# Altium project LO.PrjPcb
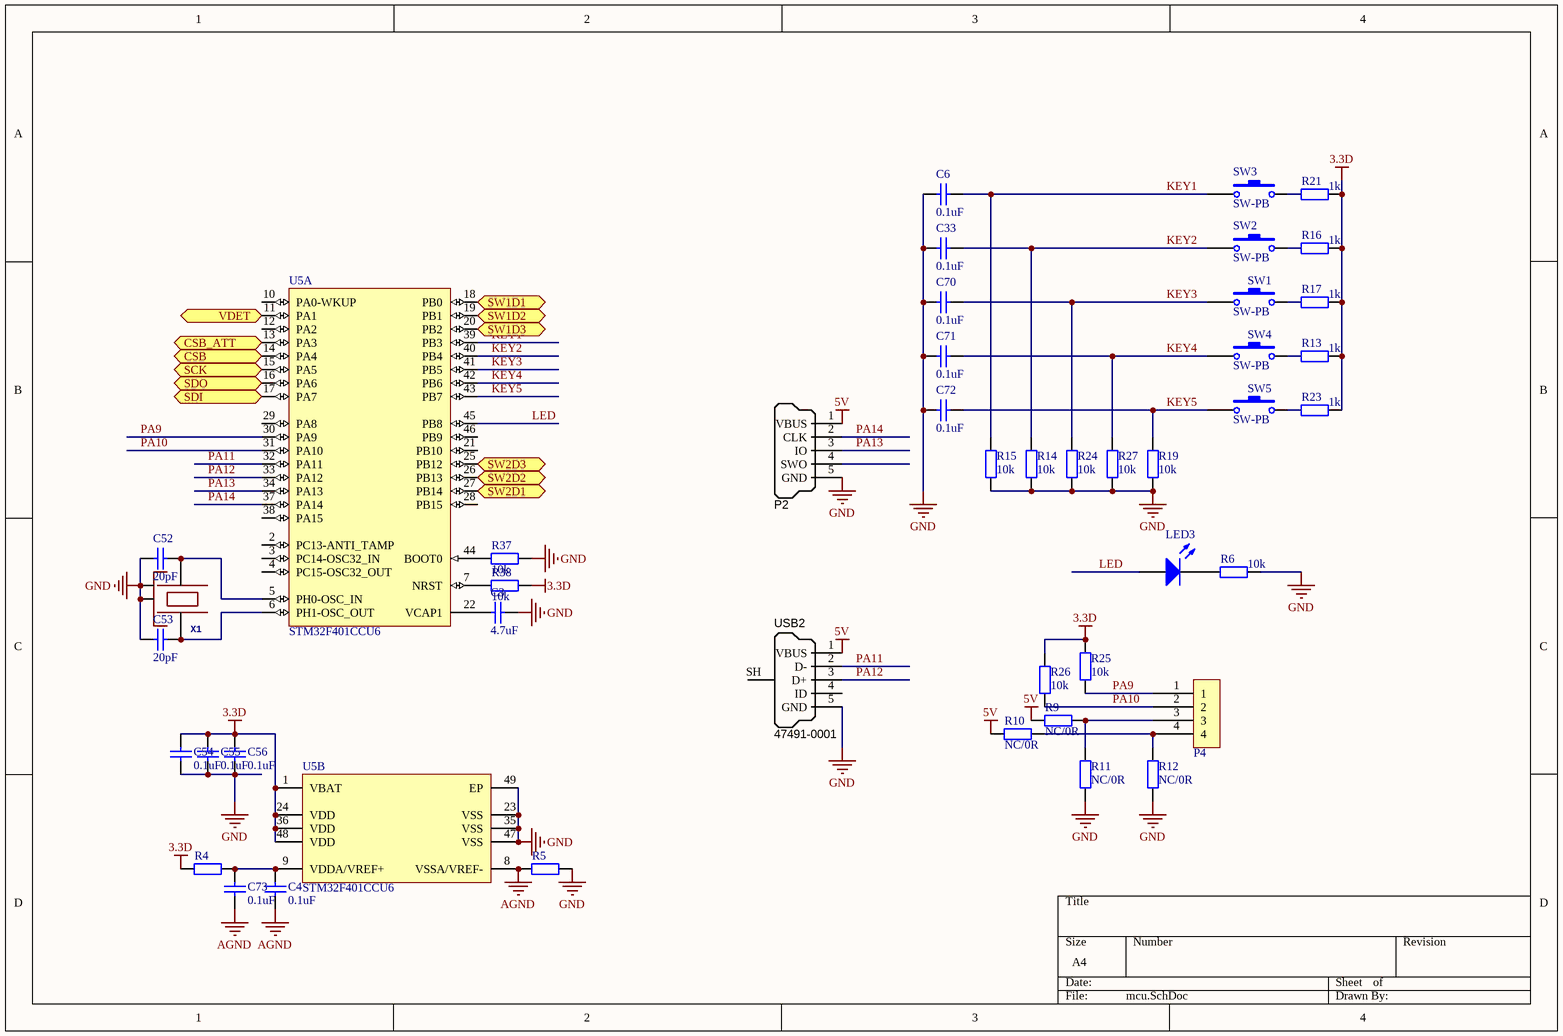
[diagram p0: mcu.SchDoc]
4 sheets, 148 parts. Net scope: flat (ports and power ports of the same name join across sheets).
Board file: LO.PcbDoc
Sheets:
  mcu.SchDoc
  filterbank_amp.SchDoc
  source.SchDoc
  power.SchDoc

## Sheet mcu.SchDoc
size A4

### Parts
C3  value 4.7uF  [0603]  (hidden comment: Cap)
C4  value 0.1uF  [0402]  (hidden comment: Cap)
C6  value 0.1uF  [0402]  (hidden comment: Cap)
C33  value 0.1uF  [0402]  (hidden comment: Cap)
C52  value 20pF  [0402]  (hidden comment: Cap)
C53  value 20pF  [0402]  (hidden comment: Cap)
C54  value 0.1uF  [0402]  (hidden comment: Cap)
C55  value 0.1uF  [0402]  (hidden comment: Cap)
C56  value 0.1uF  [0402]  (hidden comment: Cap)
C70  value 0.1uF  [0402]  (hidden comment: Cap)
C71  value 0.1uF  [0402]  (hidden comment: Cap)
C72  value 0.1uF  [0402]  (hidden comment: Cap)
C73  value 0.1uF  [0402]  (hidden comment: Cap)
LED3  LED0  [0603]  (value not drawn)
P2  SWD_MicroUSB  [MICRO-YZX]  (value not drawn)
P4  UART/I2C  [4pSocket]  (value not drawn)
R4  0R/FB  [0402]  (value not drawn)
R5  0R/FB  [0402]  (value not drawn)
R6  10k  [0402]
R9  NC/0R  [0402]
R10  NC/0R  [0402]
R11  NC/0R  [0402]
R12  NC/0R  [0402]
R13  1k  [0402]
R14  10k  [0402]
R15  10k  [0402]
R16  1k  [0402]
R17  1k  [0402]
R19  10k  [0402]
R21  1k  [0402]
R23  1k  [0402]
R24  10k  [0402]
R25  10k  [0402]
R26  10k  [0402]
R27  10k  [0402]
R37  value 10k  [0402]  (hidden comment: Res2)
R38  value 10k  [0402]  (hidden comment: Res2)
SW1  SW-PB  [SW3x4]
SW2  SW-PB  [SW3x4]
SW3  SW-PB  [SW3x4]
SW4  SW-PB  [SW3x4]
SW5  SW-PB  [SW3x4]
U5  STM32F401CCU6  [STM-UFQFPN48_N]  (parts A,B of 2)
USB2  Manufacturer Part Number 1: 47491-0001  [MICRO-YZX]  (hidden comment: USB Micro Type B)
X1  24.000 KHz 3.2x2.5mm 8-10pf  [OSCILLATOR-3.2X2.5]  (value not drawn)

### Ports
CSB, CSB_ATT, SCK, SDI, SDO, SW1D1, SW1D2, SW1D3, SW2D1, SW2D2, SW2D3, VDET

### Nets
3.3D: C54.2 C55.2 C56.2 R4.2 R13.2 R16.2 R17.2 R21.2 R23.2 R25.2 R26.2 R38.1 U5.1(VBAT) U5.24(VDD) U5.36(VDD) U5.48(VDD)
5V: P2.1(VBUS) R9.2 R10.2 USB2.1(VBUS)
AGND: C4.1 C73.1 R5.2 U5.8(VSSA/VREF-)
GND: C3.1 C6.1 C33.2 C52.1 C53.1 C54.1 C55.1 C56.1 C70.2 C71.2 C72.2 P2.5(GND) R5.1 R6.2 R11.1 R12.1 R14.1 R15.1 R19.1 R24.1 R27.1 R37.2 U5.23(VSS) U5.35(VSS) U5.47(VSS) U5.49(EP) USB2.5(GND) X1.2(NC_2) X1.4(NC_4)
KEY1: C6.2 R15.2 SW3.1 U5.39(PB3)
KEY2: C33.1 R14.2 SW2.1 U5.40(PB4)
KEY3: C70.1 R24.2 SW1.1 U5.41(PB5)
KEY4: C71.1 R27.2 SW4.1 U5.42(PB6)
KEY5: C72.1 R19.2 SW5.1 U5.43(PB7)
LED: LED3.1(A) U5.45(PB8)
PA9: P4.1 R25.1 U5.30(PA9)
PA10: P4.2 R26.1 U5.31(PA10)
PA11: U5.32(PA11) USB2.2(D-)
PA12: U5.33(PA12) USB2.3(D+)
PA13: P2.3(IO) U5.34(PA13)
PA14: P2.2(CLK) U5.37(PA14)
NetC3_2: C3.2 U5.22(VCAP1)
NetC4_2: C4.2 C73.2 R4.1 U5.9(VDDA/VREF+)
NetC52_2: C52.2 U5.5(PH0-OSC_IN) X1.1
NetC53_2: C53.2 U5.6(PH1-OSC_OUT) X1.3
NetLED3_2: LED3.2(K) R6.1
NetP4_3: P4.3 R9.1 R11.2
NetP4_4: P4.4 R10.1 R12.2
NetR13_1: R13.1 SW4.2
NetR16_1: R16.1 SW2.2
NetR17_1: R17.1 SW1.2
NetR21_1: R21.1 SW3.2
NetR23_1: R23.1 SW5.2
NetR37_1: R37.1 U5.44(BOOT0)
NetR38_2: R38.2 U5.7(NRST)
NetU3_9: U5.18(PB0) ; port SW1D1
NetU3_10: U5.19(PB1) ; port SW1D2
NetU3_11: U5.20(PB2) ; port SW1D3
NetU4_9: U5.27(PB14) ; port SW2D1
NetU4_10: U5.26(PB13) ; port SW2D2
NetU4_11: U5.25(PB12) ; port SW2D3
NetU5_11: U5.11(PA1) ; port VDET
NetU5_13: U5.13(PA3) ; port CSB_ATT
NetU5_14: U5.14(PA4) ; port CSB
NetU5_15: U5.15(PA5) ; port SCK
NetU5_16: U5.16(PA6) ; port SDO
NetU5_17: U5.17(PA7) ; port SDI

Not connected (* = marked no-connect by the designer): P2 4(SWO); U5 2(PC13-ANTI_TAMP) 3(PC14-OSC32_IN) 4(PC15-OSC32_OUT) 10(PA0-WKUP) 12(PA2) 21(PB10) 28(PB15) 29(PA8) 38(PA15) 46(PB9); USB2 4(ID) SH(Shell)

### Library data of the parts
C3 C4 C6 C33 C52-C56 C70-C73 = Cap: Capacitor; Published: 8-Jun-2000; LatestRevisionDate: 17-Jul-2002; LatestRevisionNote: Re-released for DXP Platform.; PackageReference: RAD-0.3; Publisher: Altium Limited; PackageDescription: Radial Cap, Thru-Hole; 2 Leads; 0.3 in Pin Spacing
LED3 = LED0: Typical INFRARED GaAs LED; Published: 8-Jun-2000; LatestRevisionDate: 08-Jul-2005; LatestRevisionNote: Mech Layer 1 removed.; PackageReference: LED-0; Publisher: Altium Limited; PackageDescription: LED; 2 Leads
P2 = SWD_MicroUSB: Connector SMD USB Micro Type B middle mount; Manufacturer 1: Molex Inc; SCDType: undef; Package / Case: SMD; Supplier 1: Digi-Key; Supplier Part Number 1: WM17142CT-ND
P4 = 4PSocket
R4 R5 R37 R38 = Res2: Resistor; Published: 8-Jun-2000; LatestRevisionDate: 17-Jul-2002; LatestRevisionNote: Re-released for DXP Platform.; PackageReference: AXIAL-0.4; Publisher: Altium Limited; PackageDescription: Axial Device, Thru-Hole; 2 Leads; 0.4 in Pin Spacing
R6 R9-R17 R19 R21 R23-R27 = Res2: Resistor; Value: 0Ohm; Published: 8-Jun-2000; LatestRevisionDate: 17-Jul-2002; LatestRevisionNote: Re-released for DXP Platform.; PackageReference: AXIAL-0.4; Publisher: Altium Limited; PackageDescription: Axial Device, Thru-Hole; 2 Leads; 0.4 in Pin Spacing
SW1-SW5 = SW-PB: Switch; Published: 24-Mar-1999; LatestRevisionDate: 17-Jul-2002; LatestRevisionNote: Re-released for DXP Platform.; PackageReference: SPST-2; Publisher: Altium Limited; PackageDescription: Switch; 2 Leads
U5 = STM32F401CCU6: ARM Cortex-M4 32-bit MCU+FPU, 105 DMIPS, 256 kB Flash, 64 kB Internal RAM, 36 I/Os, 48-pin UFQFPN, -40 to 85 degC, Tray; Manufacturer: STMicroelectronics; FLASH Size (Prog) (kB): 256; I/Os (High Current): 36; Internal RAM Size (kB): 64; Operating Frequency(F) (Processor speed) (MHz): 84; Supply Voltage(Vcc) max (V): 3.6; Supply Voltage(Vcc) min (V): 1.8; DatasheetVersion: Rev. 1; PackageVersion: Rev. 1, 04/2013; PackageReference: UFQFPN48; PackageDescription: 48-Pin Ultra Thin Fine Pitch Quad Flat No-Lead, 7 x 7 x 0.6 mm Body, 0.5 mm Pitch, Exposed Pad; Supplier 1: Newark; Supplier Part Number 1: 19X6217; Supplier 2: Mouser; Supplier Part Number 2: 511-STM32F401CCU6; Core: ARM Cortex-M4; Packing: Tray; Mounting Technology: Surface Mount; PartNumber: STM32F401CCU6; ComponentLink1Description: Manufacturer URL; ComponentLink1URL: http://www.st.com/web/en/home.html; ComponentLink2Description: Datasheet; ComponentLink2URL: http://www.st.com/st-web-ui/static/active/en/resource/technical/document/data_brief/DM00071938.pdf; ComponentLink3Description: Package Specification; ComponentLink3URL: http://www.st.com/st-web-ui/static/active/en/resource/technical/document/data_brief/DM00071938.pdf
USB2 = USB_Micro_TypeB: Connector SMD USB Micro Type B middle mount; Manufacturer 1: Molex Inc; SCDType: undef; Package / Case: SMD; Supplier 1: Digi-Key; Supplier Part Number 1: WM17142CT-ND
X1 = OSCILLATOR-3.2X2.5: Crystal Oscillator in 3.2x2.5 SMD

## Sheet filterbank_amp.SchDoc
size A3
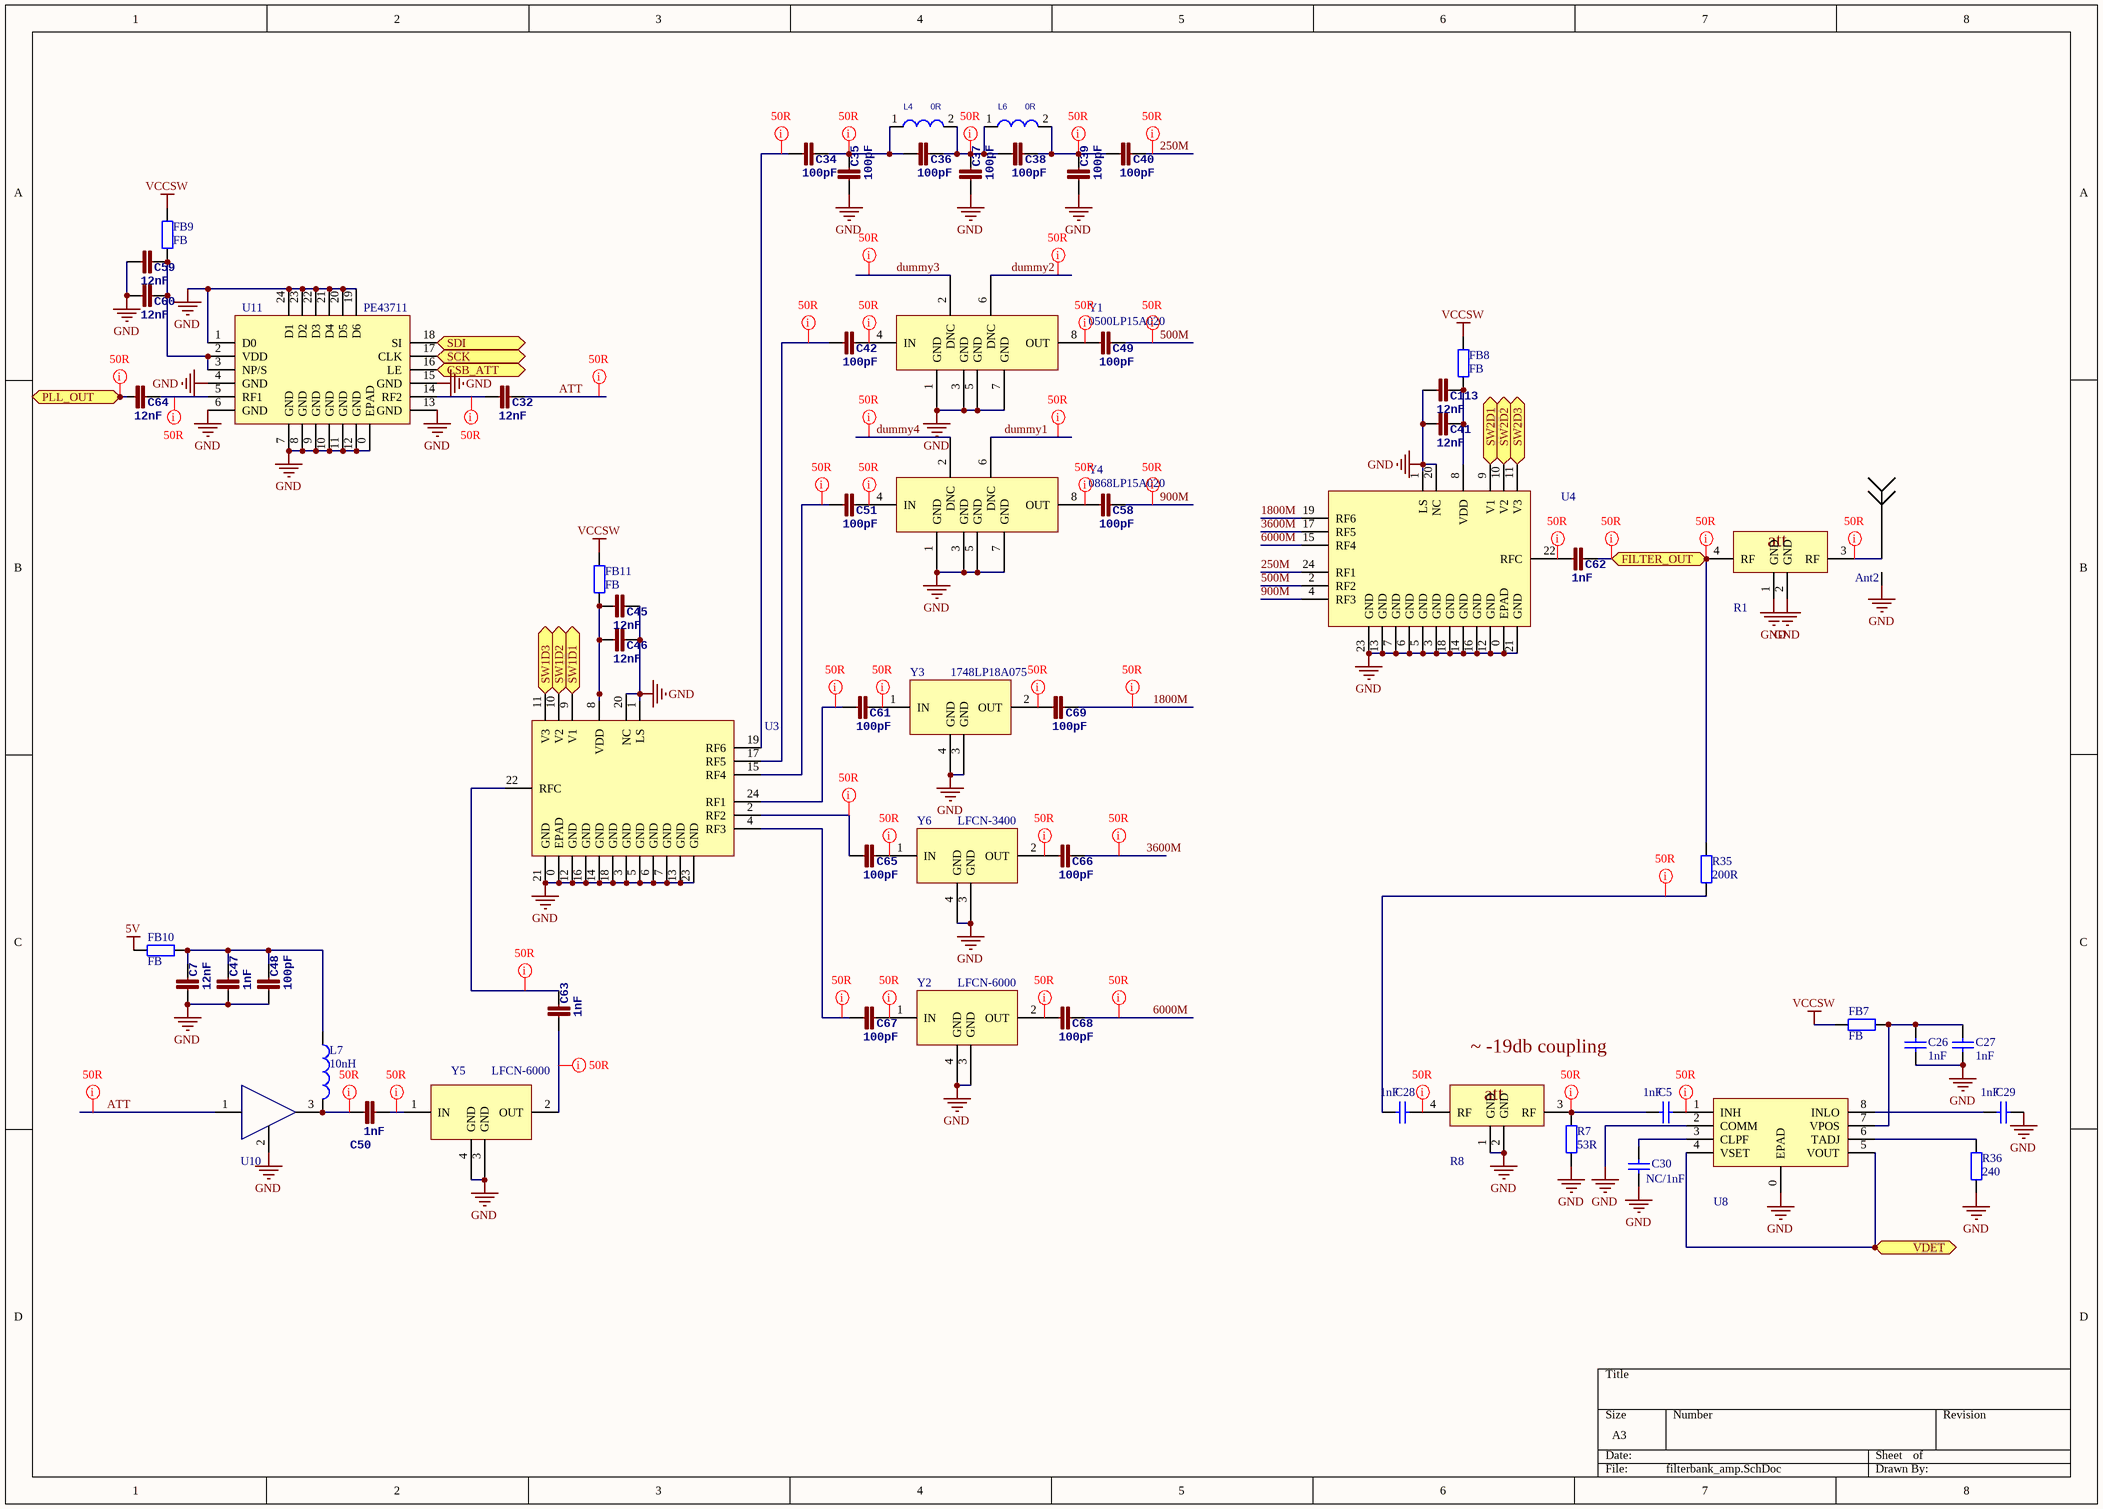
[diagram p1: filterbank_amp.SchDoc]

### Parts
Ant2  Antenna  [SMA-2]  (value not drawn)
C5  1nF  [0402]
C7  12nF  [0805]
C26  1nF  [0402]
C27  1nF  [0402]
C28  1nF  [0402]
C29  1nF  [0402]
C30  NC/1nF  [0402]
C32  12nF  [0402]
C34  100pF  [0402]
C35  100pF  [0402]
C36  100pF  [0402]
C37  100pF  [0402]
C38  100pF  [0402]
C39  100pF  [0402]
C40  100pF  [0402]
C41  12nF  [0402]
C42  100pF  [0402]
C45  12nF  [0402]
C46  12nF  [0402]
C47  1nF  [0402]
C48  100pF  [0402]
C49  100pF  [0402]
C50  1nF  [0402]
C51  100pF  [0402]
C58  100pF  [0402]
C59  12nF  [0402]
C60  12nF  [0402]
C61  100pF  [0402]
C62  1nF  [0402]
C63  1nF  [0402]
C64  12nF  [0402]
C65  100pF  [0402]
C66  100pF  [0402]
C67  100pF  [0402]
C68  100pF  [0402]
C69  100pF  [0402]
C113  12nF  [0402]
FB7  FB  [0402]
FB8  FB  [0402]
FB9  FB  [0402]
FB10  FB  [0402]
FB11  FB  [0402]
L4  0R  [0402]
L6  0R  [0402]
L7  value 10nH  [0402]  (hidden comment: Inductor)
R1  EXB24-RF-ATT  [EXB24AT-RF-ATT]  (value not drawn)
R7  53R  [0402]
R8  EXB24-RF-ATT  [EXB24AT-RF-ATT]  (value not drawn)
R35  200R  [0402]
R36  240  [0402]
U3  PE42462  [PE42462]  (value not drawn)
U4  PE42462  [PE42462]  (value not drawn)
U8  AD8319  [AD8319]  (value not drawn)
U10  AMP-SOT89  [SOT-89]  (value not drawn)
U11  PE43711  [PE43711]
Y1  0500LP15A020  [5515LP15A730/0868LP15A020]
Y2  LFCN-6000  [1748LP18A075]
Y3  1748LP18A075  [1748LP18A075]
Y4  0868LP15A020  [5515LP15A730/0868LP15A020]
Y5  LFCN-6000  [1748LP18A075]
Y6  LFCN-3400  [1748LP18A075]

### Ports
CSB_ATT, FILTER_OUT, PLL_OUT, SCK, SDI, SW1D1, SW1D2, SW1D3, SW2D1, SW2D2, SW2D3, VDET

### Nets
5V: FB10.1
GND: Ant2.GND(G) C7.1 C26.1 C27.1 C29.2 C30.1 C35.1 C37.1 C39.1 C41.1 C45.2 C46.2 C47.1 C48.1 C59.1 C60.1 C113.1 R1.1(GND) R1.2(GND) R7.2 R8.1(GND) R8.2(GND) R36.2 U3.0(EPAD) U3.1(LS) U3.3(GND) U3.5(GND) U3.6(GND) U3.7(GND) U3.12(GND) U3.13(GND) U3.14(GND) U3.16(GND) U3.18(GND) U3.20(NC) U3.21(GND) U3.23(GND) U4.0(EPAD) U4.1(LS) U4.3(GND) U4.5(GND) U4.6(GND) U4.7(GND) U4.12(GND) U4.13(GND) U4.14(GND) U4.16(GND) U4.18(GND) U4.20(NC) U4.21(GND) U4.23(GND) U8.0(EPAD) U8.2(COMM) U10.2 U11.0(EPAD) U11.1(D0) U11.4(GND) U11.6(GND) U11.7(GND) U11.8(GND) U11.9(GND) U11.10(GND) U11.11(GND) U11.12(GND) U11.13(GND) U11.15(GND) U11.19(D6) U11.20(D5) U11.21(D4) U11.22(D3) U11.23(D2) U11.24(D1) Y1.1(GND) Y1.3(GND) Y1.5(GND) Y1.7(GND) Y2.3(GND) Y2.4(GND) Y3.3(GND) Y3.4(GND) Y4.1(GND) Y4.3(GND) Y4.5(GND) Y4.7(GND) Y5.3(GND) Y5.4(GND) Y6.3(GND) Y6.4(GND)
VCCSW: FB7.1 FB8.2 FB9.2 FB11.2
250M: C40.2 U4.24(RF1)
500M: C49.2 U4.2(RF2)
900M: C58.2 U4.4(RF3)
1800M: C69.2 U4.19(RF6)
3600M: C66.2 U4.17(RF5)
6000M: C68.2 U4.15(RF4)
ATT: C32.2 U10.1
dummy1: Y4.6(DNC)
dummy2: Y1.6(DNC)
dummy3: Y1.2(DNC)
dummy4: Y4.2(DNC)
NetAnt2_1: Ant2.1 R1.3(RF)
NetC5_1: C5.1 R7.1 R8.3(RF)
NetC5_2: C5.2 U8.1(INH)
NetC7_2: C7.2 C47.2 C48.2 FB10.2 L7.1
NetC26_2: C26.2 C27.2 FB7.2 U8.7(VPOS)
NetC28_1: C28.1 R35.2
NetC28_2: C28.2 R8.4(RF)
NetC29_1: C29.1 U8.8(INLO)
NetC30_2: C30.2 U8.3(CLPF)
NetC32_1: C32.1 U11.14(RF2)
NetC34_1: C34.1 U3.19(RF6)
NetC34_2: C34.2 C35.2 C36.1 L4.1
NetC36_2: C36.2 C37.2 C38.1 L4.2 L6.1
NetC38_2: C38.2 C39.2 C40.1 L6.2
NetC41_2: C41.2 C113.2 FB8.1 U4.8(VDD)
NetC42_1: C42.1 U3.17(RF5)
NetC42_2: C42.2 Y1.4(IN)
NetC45_1: C45.1 C46.1 FB11.1 U3.8(VDD)
NetC49_1: C49.1 Y1.8(OUT)
NetC50_1: C50.1 L7.2 U10.3
NetC50_2: C50.2 Y5.1(IN)
NetC51_1: C51.1 U3.15(RF4)
NetC51_2: C51.2 Y4.4(IN)
NetC58_1: C58.1 Y4.8(OUT)
NetC59_2: C59.2 C60.2 FB9.1 U11.2(VDD) U11.3(NP/S)
NetC61_1: C61.1 U3.24(RF1)
NetC61_2: C61.2 Y3.1(IN)
NetC62_1: C62.1 U4.22(RFC)
NetC62_2: C62.2 R1.4(RF) R35.1 ; port FILTER_OUT
NetC63_1: C63.1 Y5.2(OUT)
NetC63_2: C63.2 U3.22(RFC)
NetC64_1: C64.1 ; port PLL_OUT
NetC64_2: C64.2 U11.5(RF1)
NetC65_1: C65.1 U3.2(RF2)
NetC65_2: C65.2 Y6.1(IN)
NetC66_1: C66.1 Y6.2(OUT)
NetC67_1: C67.1 U3.4(RF3)
NetC67_2: C67.2 Y2.1(IN)
NetC68_1: C68.1 Y2.2(OUT)
NetC69_1: C69.1 Y3.2(OUT)
NetR36_1: R36.1 U8.6(TADJ)
NetU3_9: U3.9(V1) ; port SW1D1
NetU3_10: U3.10(V2) ; port SW1D2
NetU3_11: U3.11(V3) ; port SW1D3
NetU4_9: U4.9(V1) ; port SW2D1
NetU4_10: U4.10(V2) ; port SW2D2
NetU4_11: U4.11(V3) ; port SW2D3
NetU5_11: U8.4(VSET) U8.5(VOUT) ; port VDET
NetU5_13: U11.16(LE) ; port CSB_ATT
NetU5_15: U11.17(CLK) ; port SCK
NetU5_17: U11.18(SI) ; port SDI

### Layout directives
net class 50R: 250M, 500M, 900M, 1800M, 3600M, 6000M, ATT, dummy1, dummy2, dummy3, dummy4, NetAnt2_1, NetC5_1, NetC5_2, NetC28_1, NetC28_2, NetC32_1, NetC34_1, NetC34_2, NetC36_2, NetC38_2, NetC42_1, NetC42_2, NetC49_1, NetC50_1, NetC50_2, NetC51_1, NetC51_2, NetC58_1, NetC61_1, NetC61_2, NetC62_1, NetC62_2, NetC63_1, NetC63_2, NetC64_1, NetC64_2, NetC65_1, NetC65_2, NetC66_1, NetC67_1, NetC67_2, NetC68_1, NetC69_1

### Notes on the sheet
- ~ -19db coupling
- (in symbol EXB24-RF-ATT) att

### Library data of the parts
C5 C26-C30 = Cap: Capacitor; Published: 8-Jun-2000; LatestRevisionDate: 17-Jul-2002; LatestRevisionNote: Re-released for DXP Platform.; PackageReference: RAD-0.3; Publisher: Altium Limited; PackageDescription: Radial Cap, Thru-Hole; 2 Leads; 0.3 in Pin Spacing
C7 C32 C34-C42 C45-C51 C58-C69 C113 = CAP0402-CAP: <b>Capacitor</b> / Standard 0603 ceramic capacitor, and 0.1" leaded capacitor.; PARTNO: CC0402ZRY5V7BB104
FB7-FB11 R7 R35 R36 = Res2: Resistor; Published: 8-Jun-2000; LatestRevisionDate: 17-Jul-2002; LatestRevisionNote: Re-released for DXP Platform.; PackageReference: AXIAL-0.4; Publisher: Altium Limited; PackageDescription: Axial Device, Thru-Hole; 2 Leads; 0.4 in Pin Spacing
L4 L6 = L/2.5*2.0
L7 = Inductor: Code_IEC: 1005; Published: 8-Jun-2000; LatestRevisionDate: 29-May-2009; LatestRevisionNote: IPC-7351 Footprint Added.; PackageReference: 0402-A; Publisher: Altium Limited; PackageDescription: Chip Inductor; Code_JEITA: 0402
Y1 Y4 = 5515LP15A730/0868LP15A020
Y2 Y5 Y6 = 1748LP18A075

## Sheet source.SchDoc
size A4
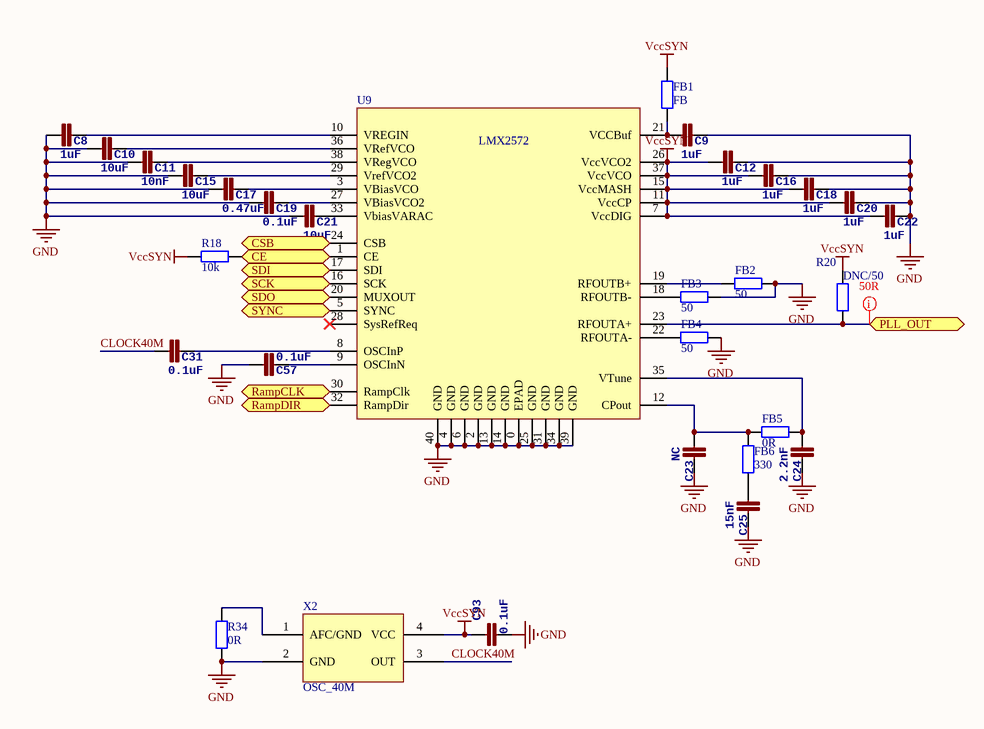
[diagram p2: source.SchDoc]

### Parts
C8  1uF  [0201]
C9  1uF  [0201]
C10  10uF  [0402]
C11  10nF  [0201]
C12  1uF  [0201]
C15  10uF  [0402]
C16  1uF  [0201]
C17  0.47uF  [0402]
C18  1uF  [0201]
C19  0.1uF  [0201]
C20  1uF  [0201]
C21  10uF  [0402]
C22  1uF  [0201]
C23  NC  [0201]
C24  2.2nF  [0201]
C25  15nF  [0201]
C31  0.1uF  [0201]
C57  0.1uF  [0201]
C93  0.1uF  [0402]
FB1  FB  [0402]
FB2  50  [0201]
FB3  50  [0201]
FB4  50  [0402]
FB5  0R  [0201]
FB6  330  [0201]
R18  10k  [0402]
R20  DNC/50  [0402]
R34  0R  [0402]
U9  LMX2572  [LMX2572]
X2  OSC_40M  [TXC_7Q]

### Ports
CE, CSB, PLL_OUT, RampCLK, RampDIR, SCK, SDI, SDO, SYNC

### Nets
GND: C8.1 C9.2 C10.1 C11.1 C12.2 C15.1 C16.2 C17.1 C18.2 C19.1 C20.2 C21.1 C22.2 C23.2 C24.2 C25.2 C57.1 C93.2 FB2.1 FB3.1 FB4.1 R34.2 U9.0(EPAD) U9.2(GND) U9.4(GND) U9.6(GND) U9.13(GND) U9.14(GND) U9.25(GND) U9.31(GND) U9.34(GND) U9.39(GND) U9.40(GND) X2.2(GND)
VccSYN: C12.1 C16.1 C18.1 C20.1 C22.1 C93.1 FB1.1 R18.1 R20.1 U9.7(VccDIG) U9.11(VccCP) U9.15(VccMASH) U9.26(VccVCO2) U9.37(VccVCO) X2.4(VCC)
CLOCK40M: C31.1 X2.3(OUT)
NetC8_2: C8.2 U9.10(VREGIN)
NetC9_1: C9.1 FB1.2 U9.21(VCCBuf)
NetC10_2: C10.2 U9.36(VRefVCO)
NetC11_2: C11.2 U9.38(VRegVCO)
NetC15_2: C15.2 U9.29(VrefVCO2)
NetC17_2: C17.2 U9.3(VBiasVCO)
NetC19_2: C19.2 U9.27(VBiasVCO2)
NetC21_2: C21.2 U9.33(VbiasVARAC)
NetC23_1: C23.1 FB5.2 FB6.2 U9.12(CPout)
NetC24_1: C24.1 FB5.1 U9.35(VTune)
NetC25_1: C25.1 FB6.1
NetC31_2: C31.2 U9.8(OSCInP)
NetC57_2: C57.2 U9.9(OSCInN)
NetC64_1: R20.2 U9.23(RFOUTA+) ; port PLL_OUT
NetFB2_2: FB2.2 U9.19(RFOUTB+)
NetFB3_2: FB3.2 U9.18(RFOUTB-)
NetFB4_2: FB4.2 U9.22(RFOUTA-)
NetR18_2: R18.2 U9.1(CE) ; port CE
NetR34_1: R34.1 X2.1(AFC/GND)
NetU5_14: U9.24(CSB) ; port CSB
NetU5_15: U9.16(SCK) ; port SCK
NetU5_16: U9.20(MUXOUT) ; port SDO
NetU5_17: U9.17(SDI) ; port SDI
NetU9_5: U9.5(SYNC) ; port SYNC
NetU9_30: U9.30(RampClk) ; port RampCLK
NetU9_32: U9.32(RampDir) ; port RampDIR

Not connected (* = marked no-connect by the designer): U9 28(SysRefReq)*

### Layout directives
net class 50R: NetC64_1

### Library data of the parts
C8-C12 C15-C25 C31 C57 C93 = CAP0402-CAP: as C7 on sheet filterbank_amp
FB1-FB6 R18 R20 = Res2: Resistor; Published: 8-Jun-2000; LatestRevisionDate: 17-Jul-2002; LatestRevisionNote: Re-released for DXP Platform.; PackageReference: AXIAL-0.4; Publisher: Altium Limited; PackageDescription: Axial Device, Thru-Hole; 2 Leads; 0.4 in Pin Spacing
R34 = Res2: Resistor; Value: 0Ohm; Published: 8-Jun-2000; LatestRevisionDate: 17-Jul-2002; LatestRevisionNote: Re-released for DXP Platform.; PackageReference: AXIAL-0.4; Publisher: Altium Limited; PackageDescription: Axial Device, Thru-Hole; 2 Leads; 0.4 in Pin Spacing

## Sheet power.SchDoc
size A4
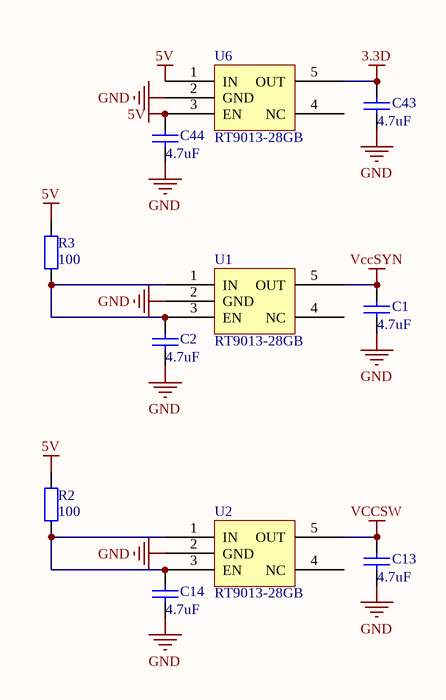
[diagram p3: power.SchDoc]

### Parts
C1  4.7uF  [0603]
C2  4.7uF  [0603]
C13  4.7uF  [0603]
C14  4.7uF  [0603]
C43  4.7uF  [0603]
C44  4.7uF  [0603]
R2  100  [0603]
R3  100  [0603]
U1  RT9013-28GB  [SOT23-5]
U2  RT9013-28GB  [SOT23-5]
U6  RT9013-28GB  [SOT23-5]

### Nets
3.3D: C43.2 U6.5(OUT)
5V: C44.2 R2.2 R3.2 U6.1(IN) U6.3(EN)
GND: C1.1 C2.1 C13.1 C14.1 C43.1 C44.1 U1.2(GND) U2.2(GND) U6.2(GND)
VCCSW: C13.2 U2.5(OUT)
VccSYN: C1.2 U1.5(OUT)
NetC2_2: C2.2 R3.1 U1.1(IN) U1.3(EN)
NetC14_2: C14.2 R2.1 U2.1(IN) U2.3(EN)

Not connected (* = marked no-connect by the designer): U1 4(NC); U2 4(NC); U6 4(NC)

### Library data of the parts
C1 C2 C13 C14 C43 C44 = Cap: Capacitor; Published: 8-Jun-2000; LatestRevisionDate: 17-Jul-2002; LatestRevisionNote: Re-released for DXP Platform.; PackageReference: RAD-0.3; Publisher: Altium Limited; PackageDescription: Radial Cap, Thru-Hole; 2 Leads; 0.3 in Pin Spacing
R2 R3 = Res2: Resistor; Value: 0Ohm; Published: 8-Jun-2000; LatestRevisionDate: 17-Jul-2002; LatestRevisionNote: Re-released for DXP Platform.; PackageReference: AXIAL-0.4; Publisher: Altium Limited; PackageDescription: Axial Device, Thru-Hole; 2 Leads; 0.4 in Pin Spacing
U1 U2 U6 = LP5907

## Nets that join several sheets
3.3D: mcu (16 pins), power (C43.2 U6.5)
5V: mcu (P2.1 R9.2 R10.2 USB2.1), filterbank_amp (FB10.1), power (5 pins)
GND: mcu (29 pins), filterbank_amp (88 pins), source (34 pins), power (9 pins)
VCCSW: filterbank_amp (FB7.1 FB8.2 FB9.2 FB11.2), power (C13.2 U2.5)
VccSYN: source (15 pins), power (C1.2 U1.5)
NetC64_1: filterbank_amp (C64.1), source (R20.2 U9.23)
NetU3_9: mcu (U5.18), filterbank_amp (U3.9)
NetU3_10: mcu (U5.19), filterbank_amp (U3.10)
NetU3_11: mcu (U5.20), filterbank_amp (U3.11)
NetU4_9: mcu (U5.27), filterbank_amp (U4.9)
NetU4_10: mcu (U5.26), filterbank_amp (U4.10)
NetU4_11: mcu (U5.25), filterbank_amp (U4.11)
NetU5_11: mcu (U5.11), filterbank_amp (U8.4 U8.5)
NetU5_13: mcu (U5.13), filterbank_amp (U11.16)
NetU5_14: mcu (U5.14), source (U9.24)
NetU5_15: mcu (U5.15), filterbank_amp (U11.17), source (U9.16)
NetU5_16: mcu (U5.16), source (U9.20)
NetU5_17: mcu (U5.17), filterbank_amp (U11.18), source (U9.17)